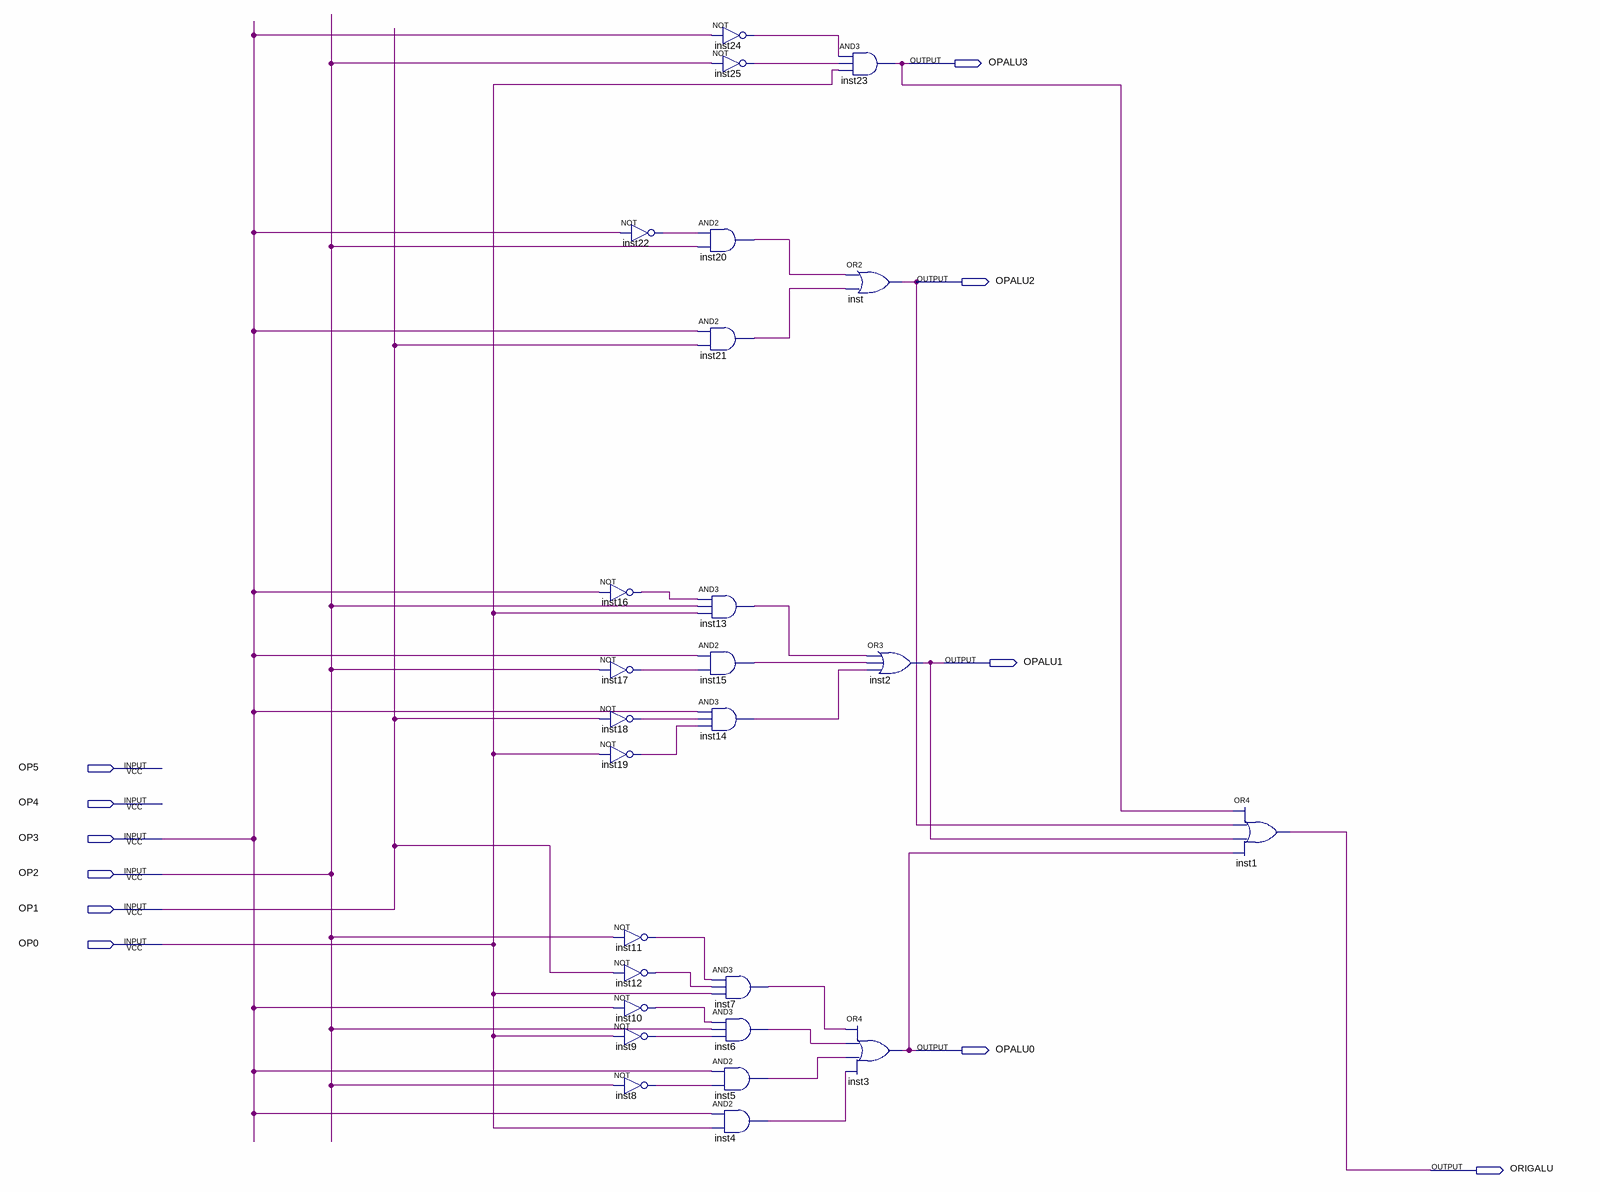
[diagram p0: schematic sheet]
// Quartus schematic OPCODETOOPALU.bdf as structural Verilog: 26 symbols, 11 pins
module OPCODETOOPALU (
  input  OP5,
  input  OP4,
  input  OP3,
  input  OP2,
  input  OP1,
  input  OP0,
  output OPALU3,
  output OPALU2,
  output OPALU1,
  output OPALU0,
  output ORIGALU
);

  wire inst4_out, inst5_out, inst6_out, inst7_out, inst8_out, inst9_out, inst10_out, inst11_out, inst12_out,
       inst13_out, inst14_out, inst15_out, inst16_out, inst17_out, inst18_out, inst19_out, inst20_out,
       inst21_out, inst22_out, inst24_out, inst25_out;

  not inst22 (inst22_out, OP3);
  not inst16 (inst16_out, OP3);
  not inst17 (inst17_out, OP2);
  not inst18 (inst18_out, OP1);
  not inst19 (inst19_out, OP0);
  not inst11 (inst11_out, OP2);
  not inst12 (inst12_out, OP1);
  not inst10 (inst10_out, OP3);
  not inst9 (inst9_out, OP0);
  not inst8 (inst8_out, OP2);
  and inst20 (inst20_out, inst22_out, OP2);
  and inst21 (inst21_out, OP3, OP1);
  and inst13 (inst13_out, inst16_out, OP2, OP0);
  and inst15 (inst15_out, OP3, inst17_out);
  and inst14 (inst14_out, OP3, inst18_out, inst19_out);
  not inst24 (inst24_out, OP3);
  not inst25 (inst25_out, OP2);
  and inst7 (inst7_out, inst11_out, inst12_out, OP0);
  and inst6 (inst6_out, inst10_out, OP2, inst9_out);
  and inst5 (inst5_out, OP3, inst8_out);
  and inst4 (inst4_out, OP3, OP0);
  and inst23 (OPALU3, inst24_out, inst25_out, OP0);
  or inst (OPALU2, inst20_out, inst21_out);
  or inst2 (OPALU1, inst13_out, inst15_out, inst14_out);
  or inst3 (OPALU0, inst7_out, inst6_out, inst5_out, inst4_out);
  or inst1 (ORIGALU, OPALU3, OPALU2, OPALU1, OPALU0);
endmodule
